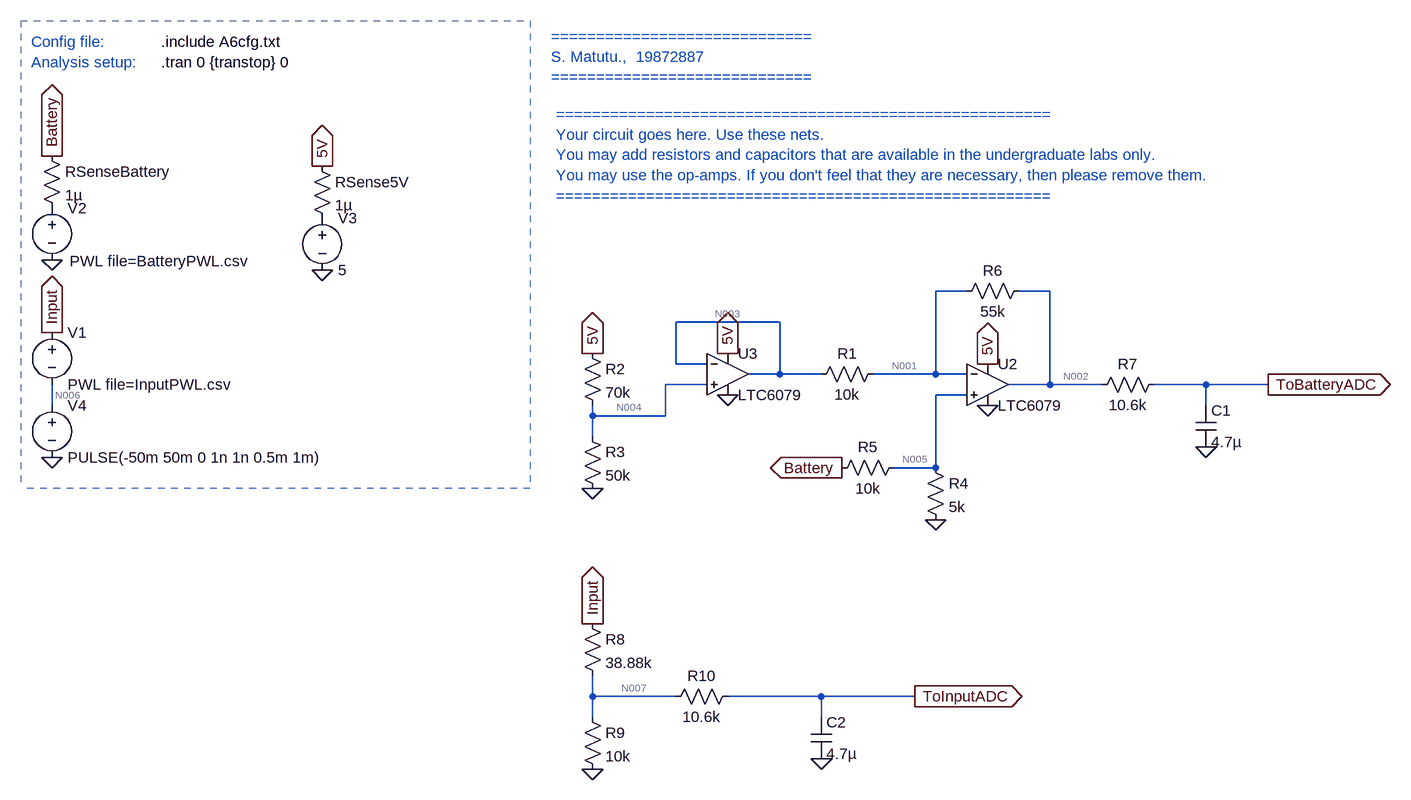
[diagram p0: schematic E344_19872887_A6.asc]
E344_19872887_A6.asc, the LTspice schematic file:
Version 4
SHEET 1 1824 680
WIRE -912 -1008 -960 -1008
WIRE -784 -1008 -832 -1008
WIRE -1200 -960 -1360 -960
WIRE -1360 -896 -1360 -960
WIRE -1312 -896 -1360 -896
WIRE -1200 -880 -1200 -960
WIRE -1200 -880 -1248 -880
WIRE -1136 -880 -1200 -880
WIRE -960 -880 -960 -1008
WIRE -960 -880 -1056 -880
WIRE -912 -880 -960 -880
WIRE -1312 -864 -1376 -864
WIRE -784 -864 -784 -1008
WIRE -784 -864 -848 -864
WIRE -704 -864 -784 -864
WIRE -544 -864 -624 -864
WIRE -448 -864 -544 -864
WIRE -912 -848 -960 -848
WIRE -2320 -832 -2320 -864
WIRE -544 -832 -544 -864
WIRE -1488 -816 -1488 -832
WIRE -1376 -816 -1376 -864
WIRE -1376 -816 -1488 -816
WIRE -1488 -784 -1488 -816
WIRE -960 -736 -960 -848
WIRE -960 -736 -1024 -736
WIRE -1488 -384 -1488 -416
WIRE -1360 -384 -1488 -384
WIRE -1136 -384 -1280 -384
WIRE -992 -384 -1136 -384
WIRE -1488 -352 -1488 -384
WIRE -1136 -352 -1136 -384
FLAG -2320 -944 Input
IOPIN -2320 -944 Out
FLAG -1904 -1040 0
FLAG -2320 -752 0
FLAG -2320 -1056 0
FLAG -992 -384 ToInputADC
IOPIN -992 -384 Out
FLAG -448 -864 ToBatteryADC
IOPIN -448 -864 Out
FLAG -1904 -1200 5V
IOPIN -1904 -1200 Out
FLAG -2320 -1216 Battery
IOPIN -2320 -1216 Out
FLAG -1104 -736 Battery
IOPIN -1104 -736 Out
FLAG -1488 -496 Input
IOPIN -1488 -496 Out
FLAG -1488 -912 5V
IOPIN -1488 -912 Out
FLAG -1280 -912 5V
IOPIN -1280 -912 Out
FLAG -880 -896 5V
IOPIN -880 -896 Out
FLAG -1280 -848 0
FLAG -880 -832 0
FLAG -1488 -704 0
FLAG -544 -768 0
FLAG -960 -656 0
FLAG -1488 -272 0
FLAG -1136 -288 0
SYMBOL voltage -2320 -960 R0
WINDOW 123 0 0 Left 0
WINDOW 39 0 0 Left 0
SYMATTR InstName V1
SYMATTR Value PWL file=InputPWL.csv
SYMBOL voltage -2320 -1152 R0
WINDOW 123 0 0 Left 0
WINDOW 39 0 0 Left 0
WINDOW 3 27 98 Left 2
SYMATTR Value PWL file=BatteryPWL.csv
SYMATTR InstName V2
SYMBOL voltage -1904 -1136 R0
WINDOW 123 0 0 Left 0
WINDOW 39 0 0 Left 0
SYMATTR InstName V3
SYMATTR Value 5
SYMBOL voltage -2320 -848 R0
WINDOW 123 0 0 Left 0
WINDOW 39 0 0 Left 0
SYMATTR InstName V4
SYMATTR Value PULSE(-50m 50m 0 1n 1n 0.5m 1m)
SYMBOL res -1920 -1216 R0
SYMATTR InstName RSense5V
SYMATTR Value 1µ
SYMBOL res -2336 -1232 R0
SYMATTR InstName RSenseBattery
SYMATTR Value 1µ
SYMBOL OpAmps\\LTC6079 -880 -864 R0
SYMATTR InstName U2
SYMBOL OpAmps\\LTC6079 -1280 -880 R0
SYMATTR InstName U3
SYMBOL res -1040 -896 R90
WINDOW 0 0 56 VBottom 2
WINDOW 3 32 56 VTop 2
SYMATTR InstName R1
SYMATTR Value 10k
SYMBOL res -1504 -928 R0
SYMATTR InstName R2
SYMATTR Value 70k
SYMBOL res -1504 -800 R0
SYMATTR InstName R3
SYMATTR Value 50k
SYMBOL res -976 -752 R0
SYMATTR InstName R4
SYMATTR Value 5k
SYMBOL res -1008 -752 R90
WINDOW 0 0 56 VBottom 2
WINDOW 3 32 56 VTop 2
SYMATTR InstName R5
SYMATTR Value 10k
SYMBOL res -816 -1024 R90
WINDOW 0 0 56 VBottom 2
WINDOW 3 32 56 VTop 2
SYMATTR InstName R6
SYMATTR Value 55k
SYMBOL res -608 -880 R90
WINDOW 0 0 56 VBottom 2
WINDOW 3 32 56 VTop 2
SYMATTR InstName R7
SYMATTR Value 10.6k
SYMBOL cap -560 -832 R0
SYMATTR InstName C1
SYMATTR Value 4.7µ
SYMBOL res -1504 -512 R0
SYMATTR InstName R8
SYMATTR Value 38.88k
SYMBOL res -1504 -368 R0
SYMATTR InstName R9
SYMATTR Value 10k
SYMBOL res -1264 -400 R90
WINDOW 0 0 56 VBottom 2
WINDOW 3 32 56 VTop 2
SYMATTR InstName R10
SYMATTR Value 10.6k
SYMBOL cap -1152 -352 R0
SYMATTR InstName C2
SYMATTR Value 4.7µ
TEXT -2152 -1360 Left 2 !.tran 0 {transtop} 0
TEXT -2152 -1392 Left 2 !.include A6cfg.txt
TEXT -2352 -1392 Left 2 ;Config file:
TEXT -2352 -1360 Left 2 ;Analysis setup:
TEXT -1552 -1400 Left 2 ;=============================\nS. Matutu.,  19872887\n=============================
TEXT -1544 -1280 Left 2 ;=======================================================\nYour circuit goes here. Use these nets.\nYou may add resistors and capacitors that are available in the undergraduate labs only.\nYou may use the op-amps. If you don't feel that they are necessary, then please remove them.\n=======================================================
LINE Normal -1584 -1424 -1584 -704 2
LINE Normal -2368 -1424 -1584 -1424 2
LINE Normal -1584 -704 -2368 -704 2
LINE Normal -1584 -720 -1584 -720 2
LINE Normal -2368 -1424 -2368 -704 2

The netlist it stands for:
* E344_19872887_A6.asc
V1 Input N006 PWL file=InputPWL.csv
V2 P001 0 PWL file=BatteryPWL.csv
V3 P002 0 5
V4 N006 0 PULSE(-50m 50m 0 1n 1n 0.5m 1m)
RSense5V 5V P002 1µ
RSenseBattery Battery P001 1µ
XU2 N005 N001 5V 0 N002 LTC6078  ; LTC6079, pins In+ In- V+ V- OUT
XU3 N004 N003 5V 0 N003 LTC6078  ; LTC6079, pins In+ In- V+ V- OUT
R1 N001 N003 10k
R2 5V N004 70k
R3 N004 0 50k
R4 N005 0 5k
R5 N005 Battery 10k
R6 N002 N001 55k
R7 ToBatteryADC N002 10.6k
C1 ToBatteryADC 0 4.7µ
R8 Input N007 38.88k
R9 N007 0 10k
R10 ToInputADC N007 10.6k
C2 ToInputADC 0 4.7µ
.tran 0 {transtop} 0
.include A6cfg.txt
* Config file:
* Analysis setup:
* =============================
* S. Matutu.,  19872887
* =============================
* =======================================================
* Your circuit goes here. Use these nets.
* You may add resistors and capacitors that are available in the undergraduate labs only.
* You may use the op-amps. If you don't feel that they are necessary, then please remove them.
* =======================================================
.lib LTC5.lib
.backanno
.end

* Results of the author's LTspice run, read from the files saved beside the schematic
* Operating Point, zero values left out:
*   V(input) = -50 mV
*   V(n006) = -50 mV
*   V(p001) = 5.7 V
*   V(p002) = 5 V
*   V(5v) = 5 V
*   V(battery) = 5.7 V
*   V(n002) = 891.7 mV
*   V(n005) = 1.9 V
*   V(n001) = 1.9 V
*   V(n003) = 2.083 V
*   V(n004) = 2.083 V
*   V(tobatteryadc) = 891.7 mV
*   V(n007) = -10.23 mV
*   V(toinputadc) = -10.23 mV
*   I(R9) = -1.023 µA
*   I(R8) = -1.023 µA
*   I(R6) = -18.33 µA
*   I(R5) = -380 µA
*   I(R4) = 380 µA
*   I(R3) = 41.67 µA
*   I(R2) = 41.67 µA
*   I(R1) = -18.33 µA
*   I(Rsensebattery) = -380 µA
*   I(Rsense5v) = -153.8 µA
*   I(V4) = 1.023 µA
*   I(V3) = -153.8 µA
*   I(V2) = -380 µA
*   I(V1) = 1.023 µA
*   Ix(u2:1) = -4.86 pA
*   Ix(u2:2) = -4.86 pA
*   Ix(u2:3) = 47.37 µA
*   Ix(u2:4) = -65.7 µA
*   Ix(u2:5) = 18.33 µA
*   Ix(u3:1) = -4.2 pA
*   Ix(u3:2) = -4.2 pA
*   Ix(u3:3) = 64.81 µA
*   Ix(u3:4) = -46.48 µA
*   Ix(u3:5) = -18.33 µA
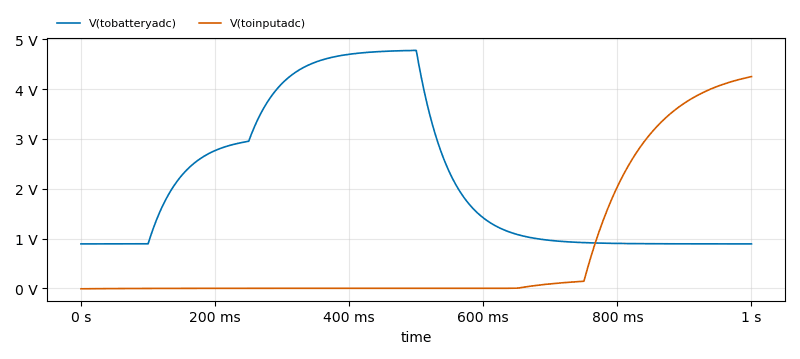
[diagram p1: Transient Analysis of E344_19872887_A6.asc, plotted from the saved traces]
* Transient Analysis, 1 run:
*   V(tobatteryadc): min 891.7 mV, max 4.779 V, average 2.192 V, rms 2.654 V, last 891.8 mV
*   V(toinputadc): min -10.23 mV, max 4.253 V, average 773.7 mV, rms 1.632 V, last 4.253 V